# Altium project kay1024_atx.PrjPCB
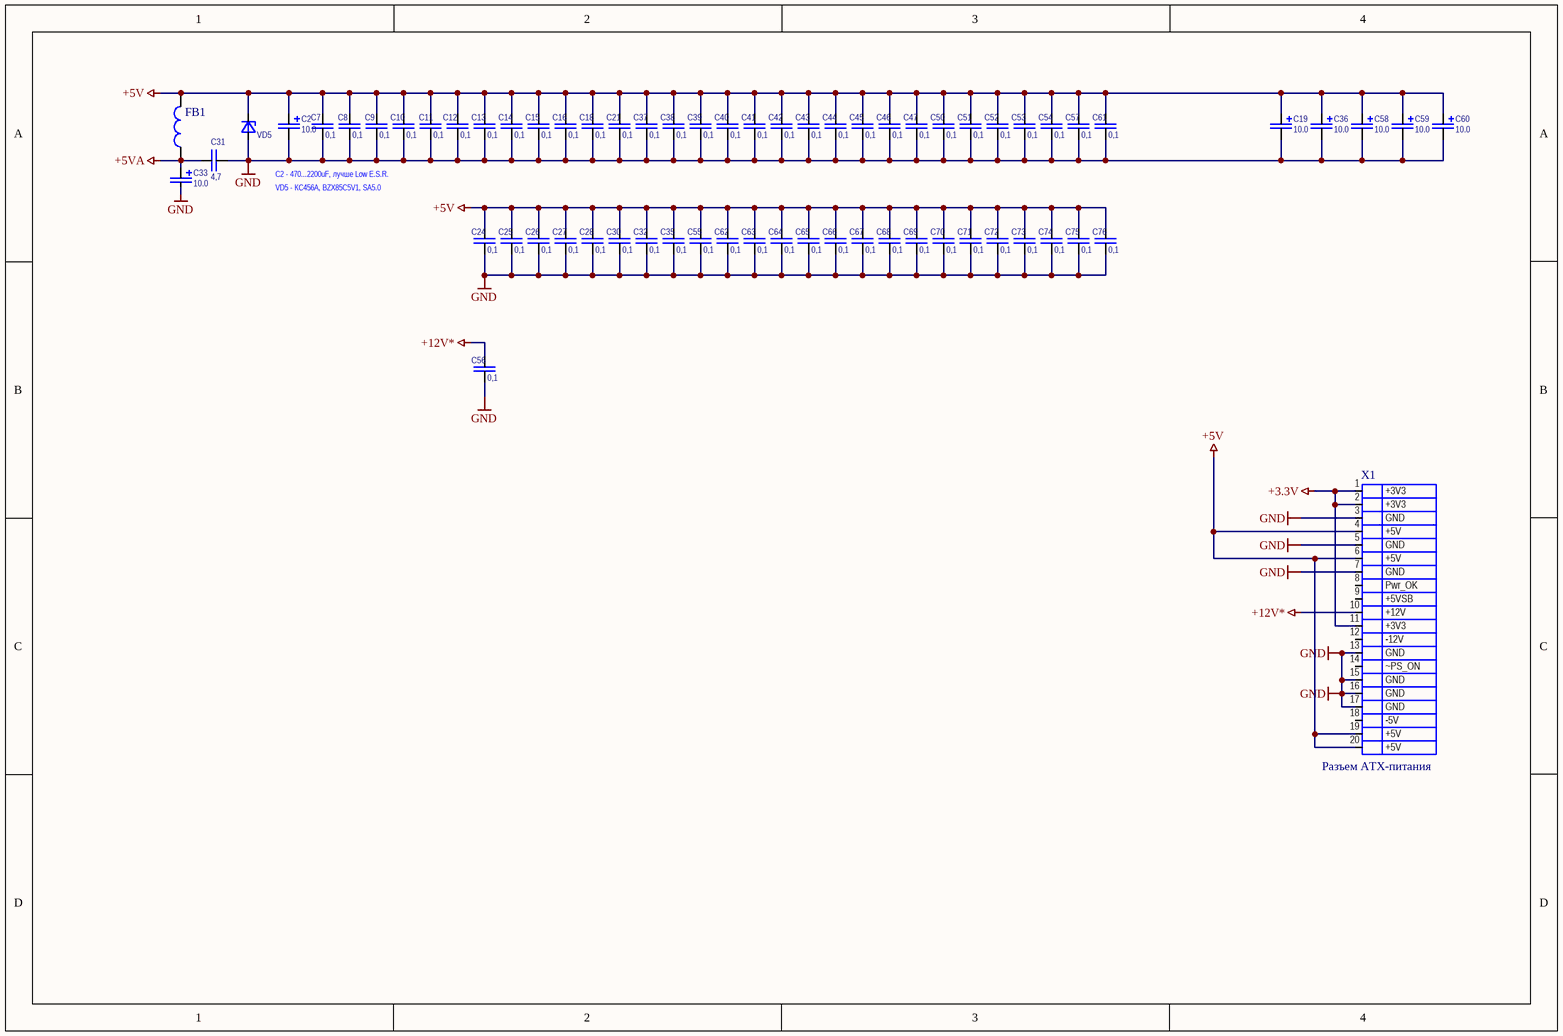
[diagram p0: Sheet5.SchDoc]
2 sheets, 79 parts. Net scope: global (net labels, ports and power ports of the same name join across sheets).
Board file: KAY1024_ATX.PcbDoc
Sheets:
  Sheet5.SchDoc
  Memory.SchDoc

## Sheet Sheet5.SchDoc
size A4

### Parts
C2  value 10.0  [AL CAP P=5]  (hidden comment: CP)
C7  value 0,1  [CAP]
C8  value 0,1  [CAP]
C9  value 0,1  [CAP]
C10  value 0,1  [CAP]
C11  value 0,1  [CAP]
C12  value 0,1  [CAP]
C13  value 0,1  [CAP]
C14  value 0,1  [CAP]
C15  value 0,1  [CAP]
C16  value 0,1  [CAP]
C18  value 0,1  [CAP]
C19  value 10.0  [AL CAP P=2.5 D=3]  (hidden comment: CP)
C21  value 0,1  [CAP]
C24  value 0,1  [CAP]
C25  value 0,1  [CAP]
C26  value 0,1  [CAP]
C27  value 0,1  [CAP]
C28  value 0,1  [CAP]
C30  value 0,1  [CAP]
C31  value 4,7  [CAP]
C32  value 0,1  [CAP]
C33  value 10.0  [AL CAP P=2.5 D=3]  (hidden comment: CP)
C35  value 0,1  [CAP]
C36  value 10.0  [AL CAP P=2.5 D=3]  (hidden comment: CP)
C37  value 0,1  [CAP]
C38  value 0,1  [CAP]
C39  value 0,1  [CAP]
C40  value 0,1  [CAP]
C41  value 0,1  [CAP]
C42  value 0,1  [CAP]
C43  value 0,1  [CAP]
C44  value 0,1  [CAP]
C45  value 0,1  [CAP]
C46  value 0,1  [CAP]
C47  value 0,1  [CAP]
C50  value 0,1  [CAP]
C51  value 0,1  [CAP]
C52  value 0,1  [CAP]
C53  value 0,1  [CAP]
C54  value 0,1  [CAP]
C55  value 0,1  [CAP]
C56  value 0,1  [CAP]
C57  value 0,1  [CAP]
C58  value 10.0  [AL CAP P=2.5 D=3]  (hidden comment: CP)
C59  value 10.0  [AL CAP P=2.5 D=3]  (hidden comment: CP)
C60  value 10.0  [AL CAP P=2.5 D=3]  (hidden comment: CP)
C61  value 0,1  [CAP]
C62  value 0,1  [CAP]
C63  value 0,1  [CAP]
C64  value 0,1  [CAP]
C65  value 0,1  [CAP]
C66  value 0,1  [CAP]
C67  value 0,1  [CAP]
C68  value 0,1  [CAP]
C69  value 0,1  [CAP]
C70  value 0,1  [CAP]
C71  value 0,1  [CAP]
C72  value 0,1  [CAP]
C73  value 0,1  [CAP]
C74  value 0,1  [CAP]
C75  value 0,1  [CAP]
C76  value 0,1  [CAP]
FB1  FBEAD  [L AIXAL]  (value not drawn)
VD5  BZX85C5V1  [BZX85C5V1]  (value not drawn)
X1  Разъем ATX-питания  [ATXPOWER]

### Nets
+3.3V: X1.1(+3V3) X1.2(+3V3) X1.11(+3V3)
+5V: C2.1 C7.1 C8.1 C9.1 C10.1 C11.1 C12.1 C13.1 C14.1 C15.1 C16.1 C18.1 C19.1 C21.1 C24.1 C25.1 C26.1 C27.1 C28.1 C30.1 C32.1 C35.1 C36.1 C37.1 C38.1 C39.1 C40.1 C41.1 C42.1 C43.1 C44.1 C45.1 C46.1 C47.1 C50.1 C51.1 C52.1 C53.1 C54.1 C55.1 C57.1 C58.1 C59.1 C60.1 C61.1 C62.1 C63.1 C64.1 C65.1 C66.1 C67.1 C68.1 C69.1 C70.1 C71.1 C72.1 C73.1 C74.1 C75.1 C76.1 FB1.2 VD5.2 X1.4(+5V) X1.6(+5V) X1.19(+5V) X1.20(+5V)
+5VA: C31.1 C33.1 FB1.1
+12V*: C56.1 X1.10(+12V)
GND: C2.2 C7.2 C8.2 C9.2 C10.2 C11.2 C12.2 C13.2 C14.2 C15.2 C16.2 C18.2 C19.2 C21.2 C24.2 C25.2 C26.2 C27.2 C28.2 C30.2 C31.2 C32.2 C33.2 C35.2 C36.2 C37.2 C38.2 C39.2 C40.2 C41.2 C42.2 C43.2 C44.2 C45.2 C46.2 C47.2 C50.2 C51.2 C52.2 C53.2 C54.2 C55.2 C56.2 C57.2 C58.2 C59.2 C60.2 C61.2 C62.2 C63.2 C64.2 C65.2 C66.2 C67.2 C68.2 C69.2 C70.2 C71.2 C72.2 C73.2 C74.2 C75.2 C76.2 VD5.1 X1.3(GND) X1.5(GND) X1.7(GND) X1.13(GND) X1.15(GND) X1.16(GND) X1.17(GND)

Not connected (* = marked no-connect by the designer): X1 8(Pwr_OK) 9(+5VSB) 12(-12V) 14(~PS_ON) 18(-5V)

### Notes on the sheet
- C2 - 470...2200uF, лучше Low E.S.R.
- VD5 - КС456А, BZX85C5V1, SA5.0

### Library data of the parts
C7-C16 C18 C21 C24-C28 C30-C32 C35 C37-C47 C50-C57 C61-C76 = C: Type: C
VD5 = BZX85C5V1: Type: ZENER
X1 = ATX POWER CONN
C2 C19 C33 C36 C58-C60 = CP: Type: CP

## Sheet Memory.SchDoc
size A4
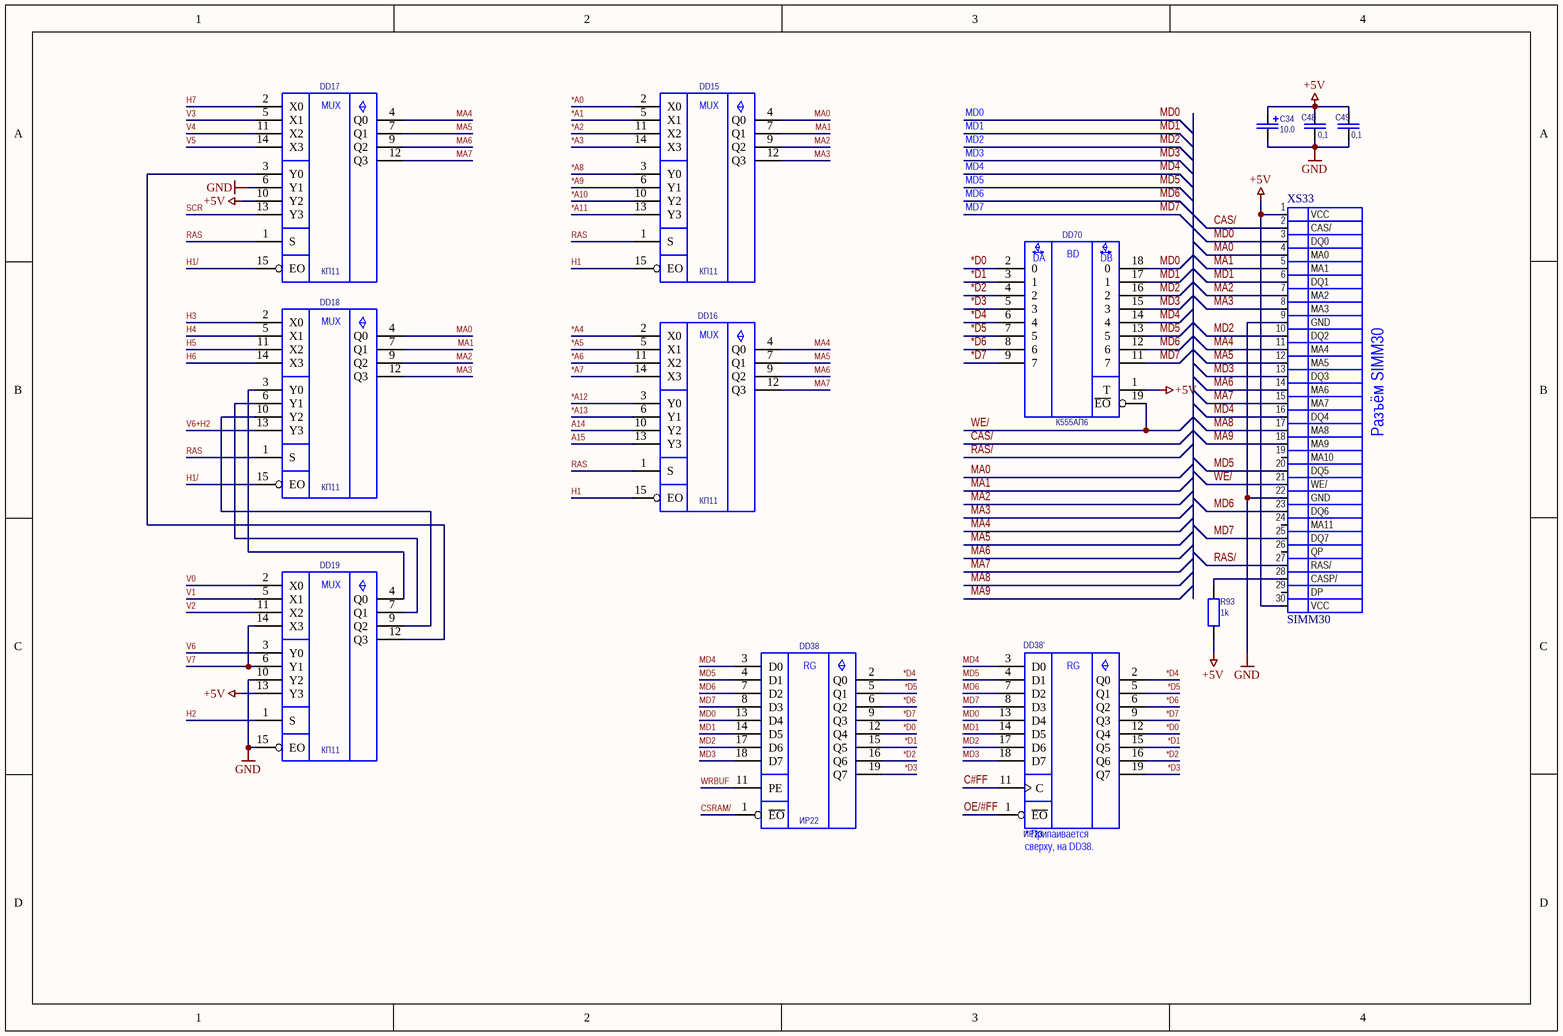
[diagram p1: Memory.SchDoc]

### Parts
C34  value 10.0  [AL CAP P=2.5 D=3]  (hidden comment: CP)
C48  value 0,1  [CAP]
C49  value 0,1  [CAP]
DD15  Type: КП11  [DIP16]
DD16  Type: КП11  [DIP16]
DD17  Type: КП11  [DIP16]
DD18  Type: КП11  [DIP16]
DD19  Type: КП11  [DIP16]
DD38  Type: ИР22  [DIP20]
DD38'  Type: ИР23  [DIP20]  (hidden comment: К555ИР23)
DD70  (no value)  [DIP20]
R93  value 1k  [RES]
XS33  SIMM30  [SIMM30]

### Nets
+5V: C34.1 C48.1 C49.1 DD15.16(+5V) DD16.16(+5V) DD17.10(Y2) DD17.16(+5V) DD18.16(+5V) DD19.13(Y3) DD19.16(+5V) DD38.20(+5V) DD38'.20(+5V) DD70.1(T) DD70.20(+5V) R93.2 XS33.1(VCC) XS33.30(VCC)
GND: C34.2 C48.2 C49.2 DD15.8(GND) DD16.8(GND) DD17.6(Y1) DD17.8(GND) DD18.8(GND) DD19.8(GND) DD19.10(Y2) DD19.15(EO) DD38.10(GND) DD38'.10(GND) DD70.10(GND) XS33.9(GND) XS33.22(GND)
*A0: DD15.2(X0)
*A1: DD15.5(X1)
*A2: DD15.11(X2)
*A3: DD15.14(X3)
*A4: DD16.2(X0)
*A5: DD16.5(X1)
*A6: DD16.11(X2)
*A7: DD16.14(X3)
*A8: DD15.3(Y0)
*A9: DD15.6(Y1)
*A10: DD15.10(Y2)
*A11: DD15.13(Y3)
*A12: DD16.3(Y0)
*A13: DD16.6(Y1)
*D0: DD38.12(Q4) DD38'.12(Q4) DD70.2(0)
*D1: DD38.15(Q5) DD38'.15(Q5) DD70.3(1)
*D2: DD38.16(Q6) DD38'.16(Q6) DD70.4(2)
*D3: DD38.19(Q7) DD38'.19(Q7) DD70.5(3)
*D4: DD38.2(Q0) DD38'.2(Q0) DD70.6(4)
*D5: DD38.5(Q1) DD38'.5(Q1) DD70.7(5)
*D6: DD38.6(Q2) DD38'.6(Q2) DD70.8(6)
*D7: DD38.9(Q3) DD38'.9(Q3) DD70.9(7)
A14: DD16.10(Y2)
A15: DD16.13(Y3)
C#FF: DD38'.11(C)
CAS/: XS33.2(CAS/)
CSRAM/: DD38.1(~{EO})
H1: DD15.15(EO) DD16.15(EO)
H1/: DD17.15(EO) DD18.15(EO)
H2: DD19.1(S)
H3: DD18.2(X0)
H4: DD18.5(X1)
H5: DD18.11(X2)
H6: DD18.14(X3)
H7: DD17.2(X0)
MA0: DD15.4(Q0) DD18.4(Q0) XS33.4(MA0)
MA1: DD15.7(Q1) DD18.7(Q1) XS33.5(MA1)
MA2: DD15.9(Q2) DD18.9(Q2) XS33.7(MA2)
MA3: DD15.12(Q3) DD18.12(Q3) XS33.8(MA3)
MA4: DD16.4(Q0) DD17.4(Q0) XS33.11(MA4)
MA5: DD16.7(Q1) DD17.7(Q1) XS33.12(MA5)
MA6: DD16.9(Q2) DD17.9(Q2) XS33.14(MA6)
MA7: DD16.12(Q3) DD17.12(Q3) XS33.15(MA7)
MA8: XS33.17(MA8)
MA9: XS33.18(MA9)
MD0: DD38.13(D4) DD38'.13(D4) DD70.18(0) XS33.3(DQ0)
MD1: DD38.14(D5) DD38'.14(D5) DD70.17(1) XS33.6(DQ1)
MD2: DD38.17(D6) DD38'.17(D6) DD70.16(2) XS33.10(DQ2)
MD3: DD38.18(D7) DD38'.18(D7) DD70.15(3) XS33.13(DQ3)
MD4: DD38.3(D0) DD38'.3(D0) DD70.14(4) XS33.16(DQ4)
MD5: DD38.4(D1) DD38'.4(D1) DD70.13(5) XS33.20(DQ5)
MD6: DD38.7(D2) DD38'.7(D2) DD70.12(6) XS33.23(DQ6)
MD7: DD38.8(D3) DD38'.8(D3) DD70.11(7) XS33.25(DQ7)
OE/#FF: DD38'.1(~{EO})
RAS: DD15.1(S) DD16.1(S) DD17.1(S) DD18.1(S)
RAS/: XS33.27(RAS/)
SCR: DD17.13(Y3)
V0: DD19.2(X0)
V1: DD19.5(X1)
V2: DD19.11(X2)
V3: DD17.5(X1)
V4: DD17.11(X2)
V5: DD17.14(X3)
V6: DD19.3(Y0)
V6+H2: DD18.13(Y3)
V7: DD19.6(Y1) DD19.14(X3)
WE/: DD70.19(~{EO}) XS33.21(WE/)
WRBUF: DD38.11(PE)
NetDD17_3: DD17.3(Y0) DD19.12(Q3)
NetDD18_3: DD18.3(Y0) DD19.4(Q0)
NetDD18_6: DD18.6(Y1) DD19.7(Q1)
NetDD18_10: DD18.10(Y2) DD19.9(Q2)
NetR93_1: R93.1 XS33.28(CASP/)

Not connected (* = marked no-connect by the designer): XS33 19(MA10) 24(MA11) 26(QP) 29(DP)

### Notes on the sheet
- MD0
- MD1
- MD2
- MD3
- MD4
- MD5
- MD6
- MD7
- Разъём SIMM30
- (near DD38') сверху, на DD38.
- (near DD38') * Припаивается
- (in symbol К555АП6) BD; DA; DB
- (in symbol К555ИР22) RG
- (in symbol К555ИР23) RG
- (in symbol К555КП11) MUX

### Library data of the parts
C48 C49 = C: Type: C
DD15-DD19 = К555КП11
DD38 = К555ИР22
DD70 = К555АП6: Type: К555АП6
R93 = RES: Type: RES
C34 = CP: Type: CP

## Nets that join several sheets
+5V: Sheet5 (66 pins), Memory (17 pins)
GND: Sheet5 (71 pins), Memory (16 pins)